# EAGLE design traning shield ver2 (EAGLE 7.2.0)
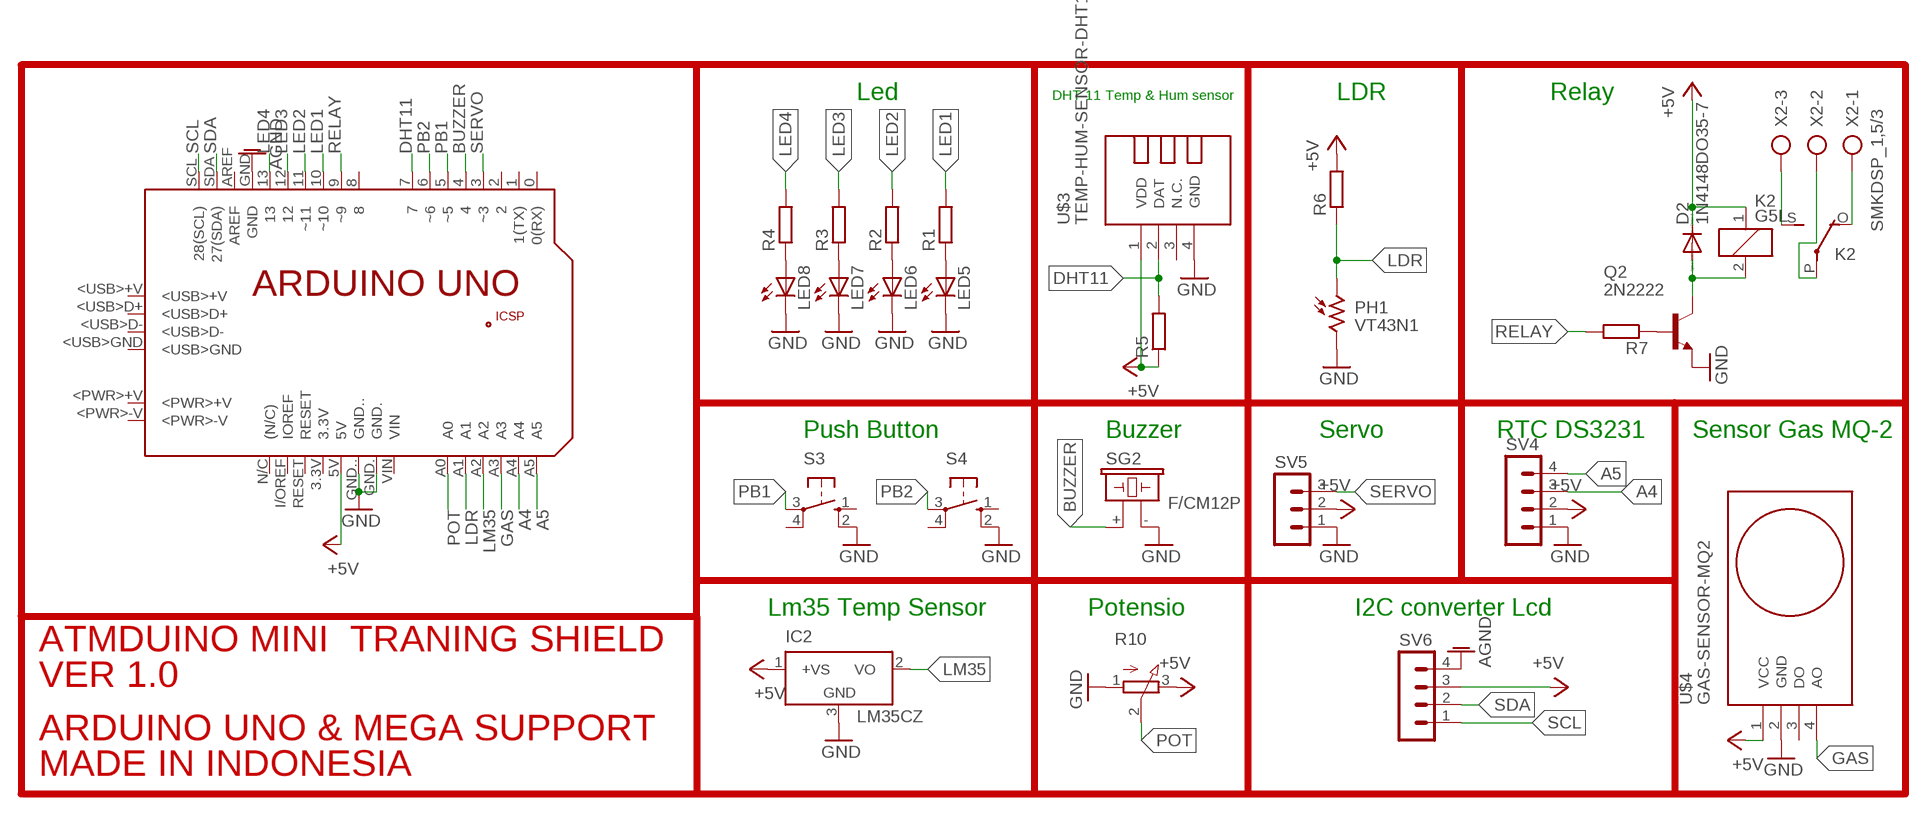
[diagram p0: schematic, sheet 1]

## Parts
D2  1N4148DO35-7  [DO35-7]
IC2  LM35CZ  [TO92]
K2  G5L  [G5LE]
LED5  LED5MM  [LED5MM]
LED6  LED5MM  [LED5MM]
LED7  LED5MM  [LED5MM]
LED8  LED5MM  [LED5MM]
PCB2  ARDUINO_UNO  [ARDUINO_UNO]
PH1  VT43N1  [VT400]
Q2  2N2222  [TO18]
R1  R-EU_0204/7  [0204/7]
R2  R-EU_0204/7  [0204/7]
R3  R-EU_0204/7  [0204/7]
R4  R-EU_0204/7  [0204/7]
R5  R-EU_0204/7  [0204/7]
R6  R-EU_0204/7  [0204/7]
R7  R-EU_0204/7  [0204/7]
R10  3RP/1610N  [3RP/1610N]
S3  10-XX  [B3F-10XX]
S4  10-XX  [B3F-10XX]
SG2  F/CM12P  [F/CM12P]
SV4  MA04-1  [MA04-1]
SV5  MA03-1  [MA03-1]
SV6  MA04-1  [MA04-1]
U$3  TEMP-HUM-SENSOR-DHT11  [TEMP-HUM-SENSOR-DHT11]
U$4  GAS-SENSOR-MQ2  [GAS-SENSOR-MQ2]
X2  SMKDSP_1,5/3  [SMKDSP_1,5/3]

## Nets
+5V: D2.C IC2.1(+VS) K2.1 PCB2.5V R5.1 R6.2 R10.3(E) SV4.2 SV5.2 SV6.3 U$3.1(VDD) U$4.1(VCC)
A4: PCB2.A4 SV4.3
A5: PCB2.A5 SV4.4
AGND: PCB2.GND SV6.4
BUZZER: PCB2.4 SG2.+
DHT11: PCB2.7 R5.2 U$3.2(DAT)
GAS: PCB2.A3 U$4.4(AO)
GND: IC2.3(GND) LED5.K(C) LED6.K(C) LED7.K(C) LED8.K(C) PCB2.GND. PCB2.GND.. PH1.2 Q2.1(E) R10.1(A) S3.2(S1) S4.2(S1) SG2.- SV4.1 SV5.1 U$3.4(GND) U$4.2(GND)
LDR: PCB2.A1 PH1.1 R6.1
LED1: PCB2.10(~10) R1.2
LED2: PCB2.11(~11) R2.2
LED3: PCB2.12 R3.2
LED4: PCB2.13 R4.2
LM35: IC2.2(VO) PCB2.A2
N$1: LED5.A R1.1
N$2: LED6.A R2.1
N$3: LED7.A R3.1
N$4: LED8.A R4.1
N$5: Q2.2(B) R7.1
N$19: D2.A K2.2 Q2.3(C)
N$20: K2.S(2:S) X2.3
N$21: K2.O(2:O) X2.1
N$22: K2.P(2:P) X2.2
PB1: PCB2.5(~5) S3.3(P)
PB2: PCB2.6(~6) S4.3(P)
POT: PCB2.A0 R10.2(S)
RELAY: PCB2.9(~9) R7.2
SCL: PCB2.SCL(28(SCL)) SV6.1
SDA: PCB2.SDA(27(SDA)) SV6.2
SERVO: PCB2.3(~3) SV5.3
Unconnected: PCB2.0(0(RX)) PCB2.1(1(TX)) PCB2.2 PCB2.3.3V PCB2.8 PCB2.+5V PCB2.<PWR>+V PCB2.<PWR>-V PCB2.<USB>+V PCB2.<USB>D+ PCB2.<USB>D- PCB2.<USB>GND PCB2.AREF PCB2.GND_ PCB2.I/OREF(IOREF) PCB2.MISO PCB2.MOSI PCB2.N/C((N/C)) PCB2.RESET PCB2.RESET. PCB2.SCK PCB2.VIN S3.1(S) S3.4(P1) S4.1(S) S4.4(P1) U$3.3(N.C.) U$4.3(DO)

## Notes on the sheet
- Led | DHT 11 Temp & Hum sensor | LDR | Relay
- Push Button | Buzzer | Servo | RTC DS3231 | Sensor Gas MQ-2
- Lm35 Temp Sensor | Potensio | I2C converter Lcd
- ATMDUINO MINI  TRANING SHIELD
- VER 1.0
- ARDUINO UNO & MEGA SUPPORT
- MADE IN INDONESIA

## Library data of the parts
D2 = diode:1N4148: DIODE high speed (Philips)
IC2 = lm35:LM35: Single-Supply Centigrade Temperature Sensor Vout = (10mV/°C x Temp °C) +5mmmV Source: http://www.national.com/ds/LM/LM35.pdf
K2 = relay:G5L: RELAY 1 x switch, 10 A/120 V AC, 8 A/30 V ADC, Omron; OC_FARNELL: unknown; OC_NEWARK: unknown
LED5-LED8 = led:LED: LED OSRAM: - CHIPLED LG R971, LG N971, LY N971, LG Q971, LY Q971, LO R971, LY R971 LH N974, LH R974 LS Q976, LO Q976, LY Q976 LO Q996 - Hyper CHIPLED LW Q18S LB Q993, LB Q99A, LB R99A - SideLED LS A670, LO A670, LY A670, LG A670, LP A670 LB A673, LV A673, LT A673, LW A673 LH A674 LY A675 LS A676, LA A676, LO A676, LY A676, LW A676 LS A679, LY A679, LG A679 - Hyper Micro SIDELED® LS Y876, LA Y876, LO Y876, LY Y876 LT Y87S - SmartLED LW L88C, LW L88S LB L89C, LB L89S, LG L890 LS L89K, LO L89K, LY L89K LS L896, LA L896, LO L896, LY L896 - TOPLED LS T670, LO T670, LY T670, LG T670, LP T670 LSG T670, LSP T670, LSY T670, LOP T670, LYG T670 LG T671, LOG T671, LSG T671 LB T673, LV T673, LT T673, LW T673 LH T674 LS T676, LA T676, LO T676, LY T676, LB T676, LH T676, LSB T676, LW T676 LB T67C, LV T67C, LT T67C, LS T67K, LO T67K, LY T67K, LW E67C LS E67B, LA E67B, LO E67B, LY E67B, LB E67C, LV E67C, LT E67C LW T67C LS T679, LY T679, LG T679 LS T770, LO T770, LY T770, LG T770, LP T770 LB T773, LV T773, LT T773, LW T773 LH T774 LS E675, LA E675, LY E675, LS T675 LS T776, LA T776, LO T776, LY T776, LB T776 LHGB T686 LT T68C, LB T68C - Hyper Mini TOPLED® LB M676 - Mini TOPLED Santana® LG M470 LS M47K, LO M47K, LY M47K Source: http://www.osram.convergy.de LUXEON: - LUMILED® LXK2-PW12-R00, LXK2-PW12-S00, LXK2-PW14-U00, LXK2-PW14-V00 LXK2-PM12-R00, LXK2-PM12-S00, LXK2-PM14-U00 LXK2-PE12-Q00, LXK2-PE12-R00, LXK2-PE12-S00, LXK2-PE14-T00, LXK2-PE14-U00 LXK2-PB12-K00, LXK2-PB12-L00, LXK2-PB12-M00, LXK2-PB14-N00, LXK2-PB14-P00, LXK2-PB14-Q00 LXK2-PR12-L00, LXK2-PR12-M00, LXK2-PR14-Q00, LXK2-PR14-R00 LXK2-PD12-Q00, LXK2-PD12-R00, LXK2-PD12-S00 LXK2-PH12-R00, LXK2-PH12-S00 LXK2-PL12-P00, LXK2-PL12-Q00, LXK2-PL12-R00 Source: www.luxeon.com KINGBRIGHT: KA-3528ASYC Source: www.kingbright.com
PCB2 = Arduino:ARDUINO_UNO: Device for representing an Arduino Uno board with a footprint in an EAGLE design. Created by Dave Young for Element14. More EAGLE documentation at: http://www.element14.com/community/community/knode/cadsoft_eagle
PH1 = photo-elements:VT43N: Photoconductive Cell VT400 Series Source: http://optoelectronics.perkinelmer.com/content/Datasheets/DTS_vt400seriesdatasheet.pdf
Q2 = transistor-npn:2N2222*: NPN Transistor
R1-R7 = resistor:R-EU_: RESISTOR, European symbol
R10 = pot:3RP/1610N: 16mm Potentiometer one level Source: http://www.alphapotentiometers.net/html/16mm_pot_2.html
S3 S4 = switch-omron:10-XX: OMRON SWITCH; MPN: B3F-1000; OC_FARNELL: 176432; OC_NEWARK: 36M3542
SG2 = buzzer:F/CM12P: BUZZER Source: Buerklin; OC_FARNELL: unknown; OC_NEWARK: unknown
SV4 SV6 = con-lstb:MA04-1: PIN HEADER; OC_FARNELL: unknown; OC_NEWARK: unknown
SV5 = con-lstb:MA03-1: PIN HEADER; OC_FARNELL: unknown; OC_NEWARK: unknown
U$3 = diy-modules:TEMP-HUM-SENSOR-DHT11: DHT11 - digital humidity & temperature sensor DHT11 datasheet available here: https://akizukidenshi.com/download/ds/aosong/DHT11.pdf Click here to find device on ebay.com <http://www.ebay.com/sch/dht11+digital+sensor>
U$4 = diy-modules:GAS-SENSOR-MQ2: Gas Sensor based on MQ-2 device Guide describing how to use MQ-2 sensor with Arduino is available here: http://www.instructables.com/id/How-to-use-MQ2-Gas-Sensor-Arduino-Tutorial/ MQ-2 sensor datasheet is available here: http://gas-sensor.ru/pdf/combustible-gas-sensor.pdf Click here to find device on ebay.com <http://www.ebay.com/sch/mq2+sensor+module+smoke>
X2 = con-phoenix-smkdsp:SMKDSP_1,5/3: Printklemme, Nennstrom: 17,5 A, Bemessungsspannung: 250 V, Raster: 5,0 mm Source: http://eshop.phoenixcontact.de .. 1733415.pdf; MF: FARNELL; MPN: 1733583; OC_FARNELL: 3041256; OC_NEWARK: 71C4130

## Board
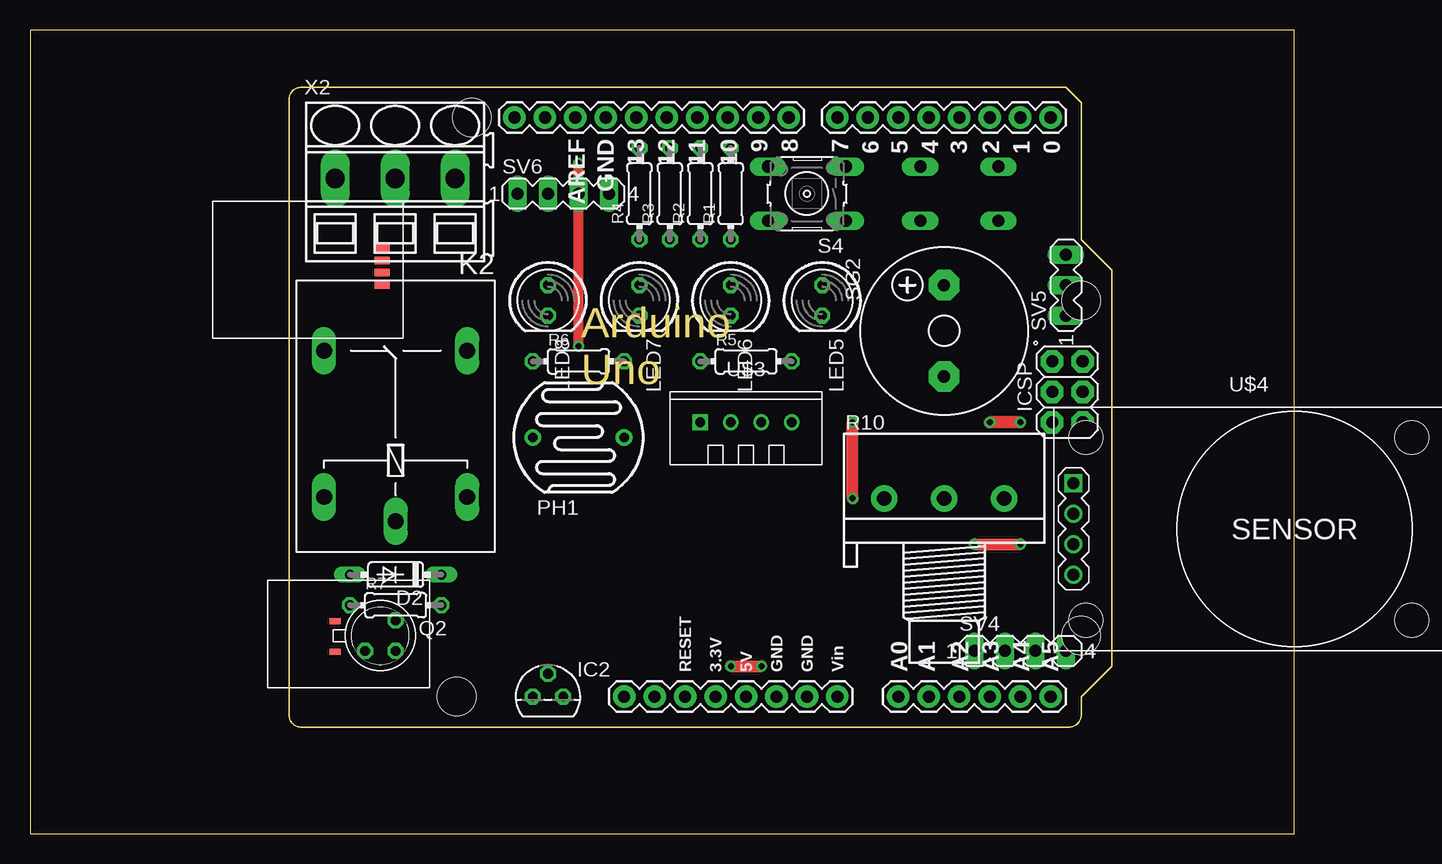
[diagram p1: board, top side]
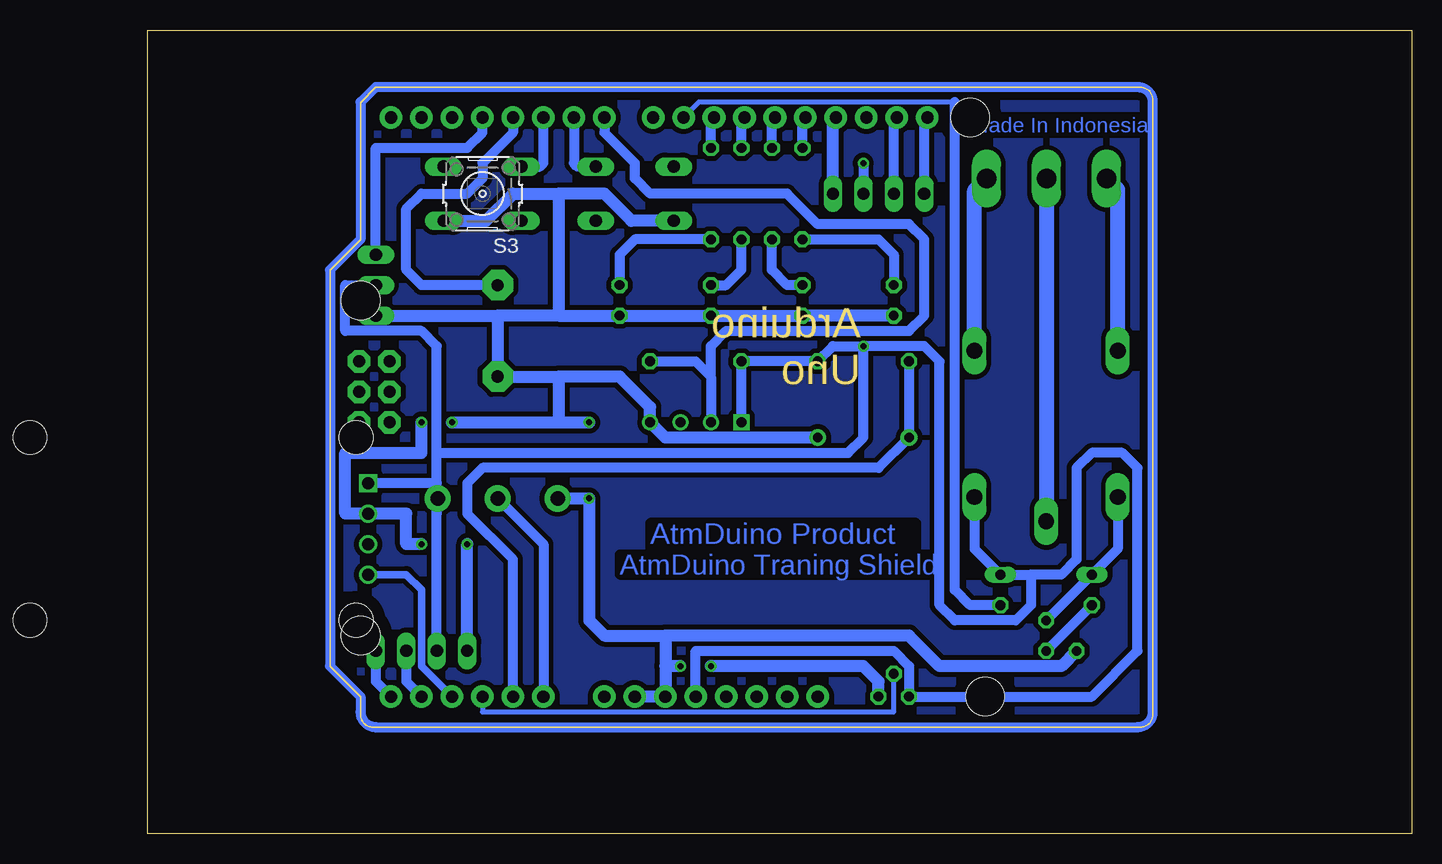
[diagram p2: board, bottom side, seen from below]

Size 105.39 x 66.98 mm. Coordinates in mm from the lower left corner, seen from the top.
Outline: 0,0 105.39,0 105.39,66.98 0,66.98 0,0
Copper layers (1*16): Top 0.035mm / dielectric 1.5mm / Bottom 0.035mm
Design rules "default": minimum track width 10mil, minimum drill 24mil, track to track 8mil, track to pad 8mil, pad to pad 8mil, via to via 8mil, smd to smd 8mil, copper to edge 40mil, drill to drill 8mil, minimum pad ring 10mil, minimum via ring 8mil, stop-mask expansion 4mil, vias tented up to drill 0mil, thermal gap 10mil

### Footprints (pad centres in the part's own frame; a part is rotated, then mirrored left to right if it is on the bottom)
DO35-7 = drill 0.813 long: A 3.81,0; C -3.81,0
TO92 = drill 0.813 octagon: 1 -1.27,0; 2 0,1.905; 3 1.27,0
G5LE = drill 1.321 long: 1 -7.493,-5.969; 2 -7.493,5.969; O 4.699,5.969; P -9.525,0; S 4.699,-5.969
LED5MM = drill 0.813 octagon: A -1.27,0; K 1.27,0
ARDUINO_UNO = drill 1.016 pad 1.88: 0 63.5,50.8; 1 60.96,50.8; 2 58.42,50.8; 3 55.88,50.8; 3.3V 35.56,2.54; 4 53.34,50.8; 5 50.8,50.8; 5V 38.1,2.54; 6 48.26,50.8; 7 45.72,50.8; 8 41.656,50.8; 9 39.116,50.8; 10 36.576,50.8; 11 34.036,50.8; 12 31.496,50.8; 13 28.956,50.8; A0 50.8,2.54; A1 53.34,2.54; A2 55.88,2.54; A3 58.42,2.54; A4 60.96,2.54; A5 63.5,2.54; AREF 23.876,50.8; GND 26.416,50.8; GND. 43.18,2.54; GND.. 40.64,2.54; I/OREF 30.48,2.54; N/C 27.94,2.54; RESET 33.02,2.54; SCL 18.796,50.8; SDA 21.336,50.8; VIN 45.72,2.54 | drill 1.016 pad 1.88 octagon: +5V 66.167,30.48; GND_ 66.167,25.4; MISO 63.627,30.48; MOSI 66.167,27.94; RESET. 63.627,25.4; SCK 63.627,27.94 | smd 1.016 x 0.508: <PWR>+V 3.861,8.814; <PWR>-V 3.861,6.274 | smd 1.27 x 0.635: <USB>+V 7.772,39.878; <USB>D+ 7.772,38.887; <USB>D- 7.772,37.871; <USB>GND 7.772,36.83 | hole 3.2: 66.04,7.62; 66.04,35.56; 15.24,50.8; 13.97,2.54
VT400 = drill 0.8 pad 1.4: 1 -3.81,0; 2 3.81,0
TO18 = drill 0.813 octagon: 1 -1.27,-1.27; 2 1.27,-1.27; 3 1.27,1.27
0204/7 = drill 0.813 octagon: 1 -3.81,0; 2 3.81,0
3RP/1610N = drill 1.2 pad 2.184: 1 -5,0; 2 0,0; 3 5,0
B3F-10XX = drill 1.016 long: 1 -3.251,2.261; 2 3.251,2.261; 3 -3.251,-2.261; 4 3.251,-2.261
F/CM12P = drill 1.016 pad 2.54 octagon: + 3.81,0; - -3.81,0
MA04-1 = drill 1.016 long: 1 -3.81,0; 2 -1.27,0; 3 1.27,0; 4 3.81,0
MA03-1 = drill 1.016 long: 1 -2.54,0; 2 0,0; 3 2.54,0
TEMP-HUM-SENSOR-DHT11 = drill 0.8 square: 1 -3.81,0 | drill 0.8: 2 -1.27,0; 3 1.27,0; 4 3.81,0
GAS-SENSOR-MQ2 = drill 1 square: 1 -14.605,3.81 | drill 1: 2 -14.605,1.27; 3 -14.605,-1.27; 4 -14.605,-3.81 | hole 2.8: -13.589,7.62; -13.589,-7.62; 13.589,-7.62; 13.589,7.62
SMKDSP_1,5/3 = drill 1.6 pad 1.8 long: 1 -2.5,0; 2 2.5,0; 3 7.5,0

### Placement (x,y rotation side)
D2  30.48,21.59 180 top
IC2  43.18,11.43 0 top
K2  30.48,35.56 90 top
LED5  66.04,44.45 270 top
LED6  58.42,44.45 270 top
LED7  50.8,44.45 270 top
LED8  43.18,44.45 270 top
PCB2  21.59,8.89 0 top
PH1  45.72,33.02 0 top
Q2  29.21,16.51 0 top
R1  58.42,53.34 90 top
R2  55.88,53.34 90 top
R3  53.34,53.34 90 top
R4  50.8,53.34 90 top
R5  59.69,39.37 0 top
R6  45.72,39.37 0 top
R7  30.48,19.05 0 top
R10  76.2,27.94 0 top
S3  77.47,53.34 180 bottom
S4  64.77,53.34 180 top
SG2  76.2,41.91 90 top
SV4  82.55,15.24 0 top
SV5  86.36,45.72 90 top
SV6  44.45,53.34 0 top
U$3  59.69,34.29 0 top
U$4  101.6,25.4 0 top
X2  27.94,54.61 0 top

### Tracks (layer width: path | path; a pad name or v marks a point on that pad's centre or on a via)
+5V  (via drill 0.5)
  Top 0.813: v45.72,40.64 v45.72,55.88
  Bottom 0.813: U$3.1 R5.1 R6.2 48.26,40.64 v45.72,40.64 | PCB2.5V 59.69,15.24 43.18,15.24 41.91,13.97 IC2.1 26.67,11.43 22.86,15.24 22.86,30.48 24.13,31.75 26.67,31.75 27.94,30.48 27.94,22.86 29.21,21.59 31.75,21.59 | SV5.2 88.9,45.72 88.9,41.91 82.55,41.91 81.28,40.64 81.28,31.75 | R10.3 81.28,26.67 | 81.28,26.67 81.28,29.21 | 81.28,29.21 U$4.1 | 81.28,29.21 81.28,31.75 | SV4.2 81.28,26.67 | 81.28,31.75 46.99,31.75 45.72,33.02 v45.72,40.64 | v45.72,55.88 SV6.3 | K2.1 36.45,23.75 D2.C 31.75,21.59 | 31.75,21.59 31.75,19.05 33.02,17.78 38.1,17.78 39.37,19.05 39.37,39.37 40.64,40.64 v45.72,40.64
A4
  Bottom 0.813: SV4.3 83.82,12.7 PCB2.A4
A5
  Bottom 0.813: SV4.4 86.36,12.7 PCB2.A5
AGND
  Bottom 1.016: SV6.4 48.26,59.44 PCB2.GND
BUZZER
  Bottom 0.813: PCB2.4 74.93,58.42 77.47,55.88 77.47,54.61 78.74,53.34 82.55,53.34 83.82,52.07 83.82,46.99 82.55,45.72 SG2.+
DHT11
  Bottom 0.813: 58.42,38.1 U$3.2 | R5.2 59.69,39.37 58.42,38.1 | 58.42,38.1 58.42,40.64 57.15,41.91 41.91,41.91 40.64,43.18 40.64,49.53 41.91,50.8 49.53,50.8 52.07,53.34 63.5,53.34 64.77,54.61 64.77,55.88 67.31,58.42 PCB2.7
GAS
  Bottom 0.61: U$4.4 83.82,21.59 82.55,20.32 82.55,13.97 PCB2.A3
GND  (via drill 0.5)
  Top 1.016: v82.55,34.29 v80.01,34.29 | v78.74,24.13 v82.55,24.13 | v58.42,13.97 v60.96,13.97 | v68.58,27.94 v68.58,34.29
  Bottom 1.016: S3.2 77.19,51.08 74.93,53.34 71.12,53.34 | S4.2 65.05,51.08 67.31,53.34 71.12,53.34 | LED8.K LED7.K LED6.K LED5.K 71.12,43.18 | 71.12,53.34 71.12,43.18 | 71.12,43.18 76.2,43.18 | 76.2,43.18 SG2.- 71.12,38.1 | SV5.1 76.2,43.18 | PH1.2 62.23,33.02 U$3.4 63.5,35.56 66.04,38.1 71.12,38.1 | PCB2.GND. PCB2.GND.. 62.23,13.97 | 71.12,38.1 71.12,34.29 | 71.12,34.29 v68.58,34.29 | v82.55,34.29 82.55,31.75 88.9,31.75 88.9,26.67 U$4.2 83.82,26.67 83.82,24.13 v82.55,24.13 | v80.01,34.29 71.12,34.29 | SV4.1 v78.74,24.13 | Q2.1 29.21,13.97 39.37,13.97 41.91,16.51 62.23,16.51 | 62.23,16.51 62.23,13.97 | IC2.3 44.45,12.7 45.72,13.97 v58.42,13.97 | v60.96,13.97 62.23,13.97 | 62.23,16.51 67.31,16.51 68.58,17.78 v68.58,27.94 R10.1
LDR
  Bottom 0.813: R6.1 PH1.1 44.45,30.48 77.47,30.48 78.74,29.21 78.74,26.67 74.93,22.86 PCB2.A1
LED1
  Bottom 0.813: R1.2 58.42,59.44 PCB2.10
LED2
  Bottom 0.813: R2.2 55.88,59.44 PCB2.11
LED3
  Bottom 0.813: R3.2 53.34,59.44 PCB2.12
LED4
  Bottom 0.813: R4.2 50.8,59.44 PCB2.13
LM35
  Bottom 0.406: PCB2.A2 77.47,10.16 43.18,10.16 IC2.2
N$1
  Bottom 0.813: R1.1 64.77,49.53 66.04,48.26 LED5.A
N$2
  Bottom 0.813: LED6.A 57.15,45.72 55.88,46.99 R2.1
N$3
  Bottom 0.813: LED7.A 52.07,45.72 53.34,46.99 R3.1
N$4
  Bottom 0.813: R4.1 44.45,49.53 43.18,48.26 LED8.A
N$5
  Bottom 0.813: R7.1 Q2.2
N$6
  pour Bottom (isolate 0.406): 22.86,62.23 86.36,62.23 87.63,60.96 87.63,49.53 90.17,46.99 90.17,13.97 87.63,11.43 87.63,10.16 arc-90 86.36,8.89 22.86,8.89 arc-90 21.59,10.16 21.59,60.96 arc-90
N$7
  Bottom 0.813: 24.13,62.23 86.36,62.23 87.63,60.96 87.63,49.53 90.17,46.99 90.17,13.97 87.63,11.43 87.63,10.16 arc-90 86.36,8.89 22.86,8.89 arc-90 21.59,10.16 21.59,60.96 arc-90 22.86,62.23 24.13,62.23
N$19
  Bottom 0.813: K2.2 24.51,23.75 D2.A Q2.3
N$20
  Bottom 1.27: K2.S 36.45,53.6 X2.3
N$21
  Bottom 1.27: K2.O 24.51,53.68 X2.1
N$22
  Bottom 1.27: X2.2 30.44,26.07 K2.P
PB1
  Bottom 0.813: PCB2.5 72.39,55.88 72.67,55.6 S3.3
PB2
  Bottom 0.813: PCB2.6 69.85,55.88 69.57,55.6 S4.3
POT
  Bottom 0.813: R10.2 72.39,24.13 PCB2.A0
RELAY
  Bottom 0.406: 38.1,60.96 59.44,60.96 PCB2.9
  Bottom 0.813: R7.2 36.83,19.05 38.1,20.32 38.1,60.96
SCL
  Bottom 0.813: SV6.1 40.64,59.44 PCB2.SCL
SDA
  Bottom 0.813: SV6.2 43.18,59.44 PCB2.SDA
SERVO
  Bottom 0.813: SV5.3 86.36,57.15 78.74,57.15 77.47,58.42 PCB2.3

### Text on the board
Bottom: Made In Indonesia | AtmDuino Product | AtmDuino Traning Shield